# Altium schematic sheet Fifo512.SchDoc
size A4; DocumentNumber: 4; SheetNumber: 4; SheetTotal: 5
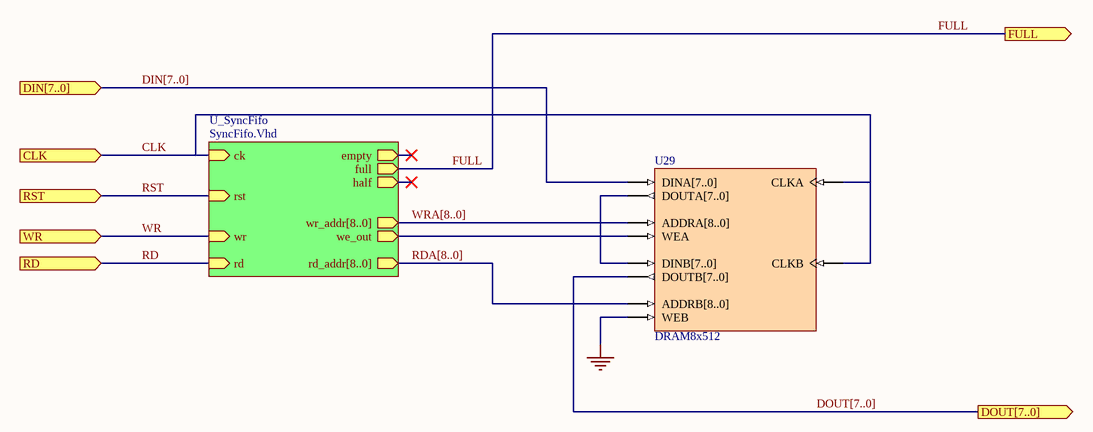
[diagram p0: Fifo512.SchDoc]

## Parts
U29  DRAM8x512

## Sub-sheets
U_SyncFifo = SyncFifo.Vhd: ck (in), empty (out), full (out), half (out), rd (in), rd_addr[8..0] (out), rst (in), we_out (out), wr (in), wr_addr[8..0] (out)  | VHDLENTITY: SyncFifo

## Ports
CLK (in), DIN[7..0] (in), DOUT[7..0] (out), FULL (out), RD (in), RST (in), WR (in)

## Nets
GND: U29.WEB
CLK: U29.CLKA U29.CLKB ; port CLK, sheet U_SyncFifo/ck
DIN[7..0]: U29.DINA[7..0] ; port DIN[7..0]
DOUT[7..0]: U29.DOUTB[7..0] ; port DOUT[7..0]
FULL: port FULL, sheet U_SyncFifo/full
RD: port RD, sheet U_SyncFifo/rd
RDA[8..0]: U29.ADDRB[8..0] ; sheet U_SyncFifo/rd_addr[8..0]
RST: port RST, sheet U_SyncFifo/rst
WR: port WR, sheet U_SyncFifo/wr
WRA[8..0]: U29.ADDRA[8..0] ; sheet U_SyncFifo/wr_addr[8..0]
NetU29_DINB[7..0]: U29.DINB[7..0] U29.DOUTA[7..0]
NetU29_WEA: U29.WEA ; sheet U_SyncFifo/we_out

## Buses and harness runs
bus DIN[7..0] = port DIN[7..0]
bus DOUT[7..0] = port DOUT[7..0]
bus RDA[8..0] = sheet U_SyncFifo/rd_addr[8..0]
bus WRA[8..0] = sheet U_SyncFifo/wr_addr[8..0]

## Library data of the parts
U29 = DRAM8x512: Dual Port Random Access Memory 512 x 8 and 512 x 8; Memory_DepthA: 512; Memory_Type: RAM_DualPortBlock; Memory_WidthA: 8; Memory_ClockEdge: Rising; Nexus_Core: Memory_Program; Published: 26/09/2003; Publisher: Altium Hobart Technology Center; Memory_DepthB: 512; Memory_WidthB: 8